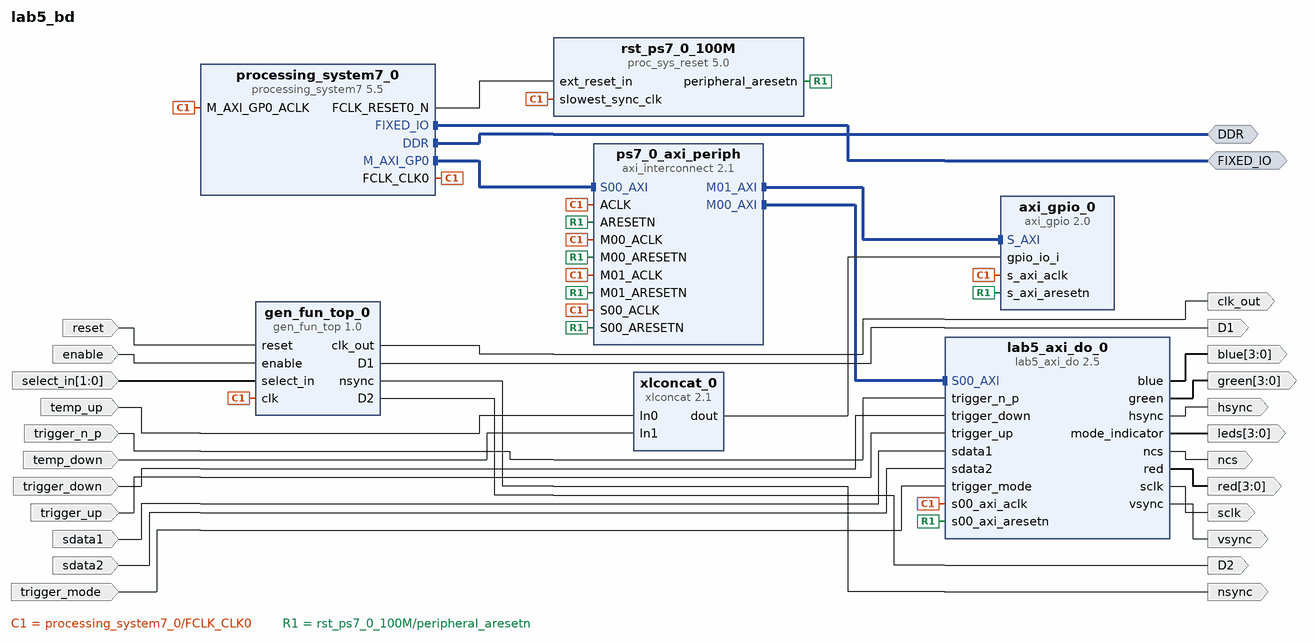
[diagram p0: block diagram of the top level]
# Vivado block design lab5_bd, xc7z020clg484-1, Vivado 2020.2
create_bd_design lab5_bd

create_bd_intf_port -mode Master -vlnv xilinx.com:interface:ddrx_rtl:1.0 DDR
create_bd_intf_port -mode Master -vlnv xilinx.com:display_processing_system7:fixedio_rtl:1.0 FIXED_IO
create_bd_port -dir O -from 3 -to 0 red
create_bd_port -dir O -from 3 -to 0 green
create_bd_port -dir O -from 3 -to 0 blue
create_bd_port -dir O hsync
create_bd_port -dir O vsync
create_bd_port -dir O ncs
create_bd_port -dir O sclk
create_bd_port -dir I sdata1
create_bd_port -dir I sdata2
create_bd_port -dir O nsync
create_bd_port -dir O D1
create_bd_port -dir O D2
create_bd_port -dir O clk_out
create_bd_port -dir I trigger_n_p
create_bd_port -dir I trigger_down
create_bd_port -dir I trigger_up
create_bd_port -dir I reset
create_bd_port -dir I enable
create_bd_port -dir I -from 1 -to 0 select_in
create_bd_port -dir I temp_up
create_bd_port -dir I temp_down
create_bd_port -dir O -from 3 -to 0 -type data leds
create_bd_port -dir I trigger_mode

create_bd_cell -type ip -vlnv xilinx.com:ip:processing_system7:5.5 processing_system7_0
set_property -dict [list \
  CONFIG.PCW_APU_PERIPHERAL_FREQMHZ 666.666667 \
  CONFIG.PCW_ENET0_ENET0_IO {MIO 16 .. 27} \
  CONFIG.PCW_ENET0_GRP_MDIO_ENABLE 1 \
  CONFIG.PCW_ENET0_GRP_MDIO_IO {MIO 52 .. 53} \
  CONFIG.PCW_ENET0_PERIPHERAL_ENABLE 1 \
  CONFIG.PCW_ENET0_RESET_ENABLE 0 \
  CONFIG.PCW_ENET_RESET_ENABLE 1 \
  CONFIG.PCW_ENET_RESET_SELECT {Share reset pin} \
  CONFIG.PCW_FPGA0_PERIPHERAL_FREQMHZ 100.000000 \
  CONFIG.PCW_FPGA1_PERIPHERAL_FREQMHZ 150.000000 \
  CONFIG.PCW_FPGA2_PERIPHERAL_FREQMHZ 50.000000 \
  CONFIG.PCW_GPIO_MIO_GPIO_ENABLE 1 \
  CONFIG.PCW_GPIO_MIO_GPIO_IO MIO \
  CONFIG.PCW_I2C_RESET_ENABLE 1 \
  CONFIG.PCW_PRESET_BANK1_VOLTAGE {LVCMOS 1.8V} \
  CONFIG.PCW_QSPI_GRP_SINGLE_SS_ENABLE 1 \
  CONFIG.PCW_QSPI_GRP_SINGLE_SS_IO {MIO 1 .. 6} \
  CONFIG.PCW_QSPI_PERIPHERAL_ENABLE 1 \
  CONFIG.PCW_QSPI_PERIPHERAL_FREQMHZ 200.000000 \
  CONFIG.PCW_QSPI_QSPI_IO {MIO 1 .. 6} \
  CONFIG.PCW_SD0_GRP_CD_ENABLE 1 \
  CONFIG.PCW_SD0_GRP_CD_IO {MIO 47} \
  CONFIG.PCW_SD0_GRP_WP_ENABLE 1 \
  CONFIG.PCW_SD0_GRP_WP_IO {MIO 46} \
  CONFIG.PCW_SD0_PERIPHERAL_ENABLE 1 \
  CONFIG.PCW_SD0_SD0_IO {MIO 40 .. 45} \
  CONFIG.PCW_SDIO_PERIPHERAL_FREQMHZ 50 \
  CONFIG.PCW_SINGLE_QSPI_DATA_MODE x4 \
  CONFIG.PCW_TTC0_PERIPHERAL_ENABLE 1 \
  CONFIG.PCW_TTC0_TTC0_IO EMIO \
  CONFIG.PCW_UART1_PERIPHERAL_ENABLE 1 \
  CONFIG.PCW_UART1_UART1_IO {MIO 48 .. 49} \
  CONFIG.PCW_UART_PERIPHERAL_FREQMHZ 50 \
  CONFIG.PCW_UIPARAM_DDR_FREQ_MHZ 533.333313 \
  CONFIG.PCW_UIPARAM_DDR_PARTNO {MT41J128M16 HA-15E} \
  CONFIG.PCW_USB0_PERIPHERAL_ENABLE 1 \
  CONFIG.PCW_USB0_RESET_ENABLE 0 \
  CONFIG.PCW_USB0_USB0_IO {MIO 28 .. 39} \
  CONFIG.PCW_USB_RESET_ENABLE 1 \
  CONFIG.PCW_USB_RESET_SELECT {Share reset pin} \
  CONFIG.preset ZedBoard \
] [get_bd_cells processing_system7_0]
# 222 more settings of processing_system7_0 are not shown: defaults, MIO pin electricals, DDR timing, and values the tool derives
create_bd_cell -type ip -vlnv xilinx.com:ip:proc_sys_reset:5.0 rst_ps7_0_100M
create_bd_cell -type ip -vlnv xilinx.com:ip:axi_interconnect:2.1 ps7_0_axi_periph
set_property -dict {CONFIG.NUM_MI 2} [get_bd_cells ps7_0_axi_periph]
create_bd_cell -type ip -vlnv xilinx.com:user:gen_fun_top:1.0 gen_fun_top_0
create_bd_cell -type ip -vlnv xilinx.com:ip:axi_gpio:2.0 axi_gpio_0
set_property -dict {CONFIG.C_GPIO_WIDTH 2 CONFIG.GPIO_BOARD_INTERFACE Custom CONFIG.USE_BOARD_FLOW true} [get_bd_cells axi_gpio_0]
create_bd_cell -type ip -vlnv xilinx.com:ip:xlconcat:2.1 xlconcat_0
create_bd_cell -type ip -vlnv UPC:user:lab5_axi_do:2.5 lab5_axi_do_0

# ---- connections ----

connect_bd_intf_net [get_bd_intf_pins processing_system7_0/M_AXI_GP0] [get_bd_intf_pins ps7_0_axi_periph/S00_AXI]
connect_bd_intf_net [get_bd_intf_pins ps7_0_axi_periph/M01_AXI] [get_bd_intf_pins axi_gpio_0/S_AXI]
connect_bd_intf_net [get_bd_intf_pins ps7_0_axi_periph/M00_AXI] [get_bd_intf_pins lab5_axi_do_0/S00_AXI]
connect_bd_intf_net [get_bd_intf_ports FIXED_IO] [get_bd_intf_pins processing_system7_0/FIXED_IO]
connect_bd_intf_net [get_bd_intf_ports DDR] [get_bd_intf_pins processing_system7_0/DDR]
connect_bd_net [get_bd_pins processing_system7_0/FCLK_CLK0] \
  [get_bd_pins rst_ps7_0_100M/slowest_sync_clk] [get_bd_pins processing_system7_0/M_AXI_GP0_ACLK] \
  [get_bd_pins ps7_0_axi_periph/S00_ACLK] [get_bd_pins ps7_0_axi_periph/M00_ACLK] [get_bd_pins ps7_0_axi_periph/ACLK] \
  [get_bd_pins gen_fun_top_0/clk] [get_bd_pins axi_gpio_0/s_axi_aclk] [get_bd_pins ps7_0_axi_periph/M01_ACLK] \
  [get_bd_pins lab5_axi_do_0/s00_axi_aclk]
connect_bd_net [get_bd_pins processing_system7_0/FCLK_RESET0_N] [get_bd_pins rst_ps7_0_100M/ext_reset_in]
connect_bd_net [get_bd_pins rst_ps7_0_100M/peripheral_aresetn] \
  [get_bd_pins ps7_0_axi_periph/S00_ARESETN] [get_bd_pins ps7_0_axi_periph/M00_ARESETN] \
  [get_bd_pins ps7_0_axi_periph/ARESETN] [get_bd_pins axi_gpio_0/s_axi_aresetn] [get_bd_pins ps7_0_axi_periph/M01_ARESETN] \
  [get_bd_pins lab5_axi_do_0/s00_axi_aresetn]
connect_bd_net [get_bd_ports reset] [get_bd_pins gen_fun_top_0/reset]
connect_bd_net [get_bd_ports enable] [get_bd_pins gen_fun_top_0/enable]
connect_bd_net [get_bd_ports select_in] [get_bd_pins gen_fun_top_0/select_in]
connect_bd_net [get_bd_pins gen_fun_top_0/clk_out] [get_bd_ports clk_out]
connect_bd_net [get_bd_pins gen_fun_top_0/nsync] [get_bd_ports nsync]
connect_bd_net [get_bd_pins gen_fun_top_0/D1] [get_bd_ports D1]
connect_bd_net [get_bd_pins gen_fun_top_0/D2] [get_bd_ports D2]
connect_bd_net [get_bd_pins xlconcat_0/dout] [get_bd_pins axi_gpio_0/gpio_io_i]
connect_bd_net [get_bd_ports trigger_n_p] [get_bd_pins lab5_axi_do_0/trigger_n_p]
connect_bd_net [get_bd_ports trigger_down] [get_bd_pins lab5_axi_do_0/trigger_down]
connect_bd_net [get_bd_ports trigger_up] [get_bd_pins lab5_axi_do_0/trigger_up]
connect_bd_net -net sdata1_1 [get_bd_ports sdata1] [get_bd_pins lab5_axi_do_0/sdata1]
connect_bd_net -net sdata2_1 [get_bd_ports sdata2] [get_bd_pins lab5_axi_do_0/sdata2]
connect_bd_net [get_bd_pins lab5_axi_do_0/red] [get_bd_ports red]
connect_bd_net [get_bd_pins lab5_axi_do_0/green] [get_bd_ports green]
connect_bd_net [get_bd_pins lab5_axi_do_0/blue] [get_bd_ports blue]
connect_bd_net [get_bd_pins lab5_axi_do_0/hsync] [get_bd_ports hsync]
connect_bd_net [get_bd_pins lab5_axi_do_0/vsync] [get_bd_ports vsync]
connect_bd_net [get_bd_pins lab5_axi_do_0/ncs] [get_bd_ports ncs]
connect_bd_net [get_bd_pins lab5_axi_do_0/sclk] [get_bd_ports sclk]
connect_bd_net [get_bd_ports temp_up] [get_bd_pins xlconcat_0/In0]
connect_bd_net [get_bd_ports temp_down] [get_bd_pins xlconcat_0/In1]
connect_bd_net [get_bd_pins lab5_axi_do_0/mode_indicator] [get_bd_ports leds]
connect_bd_net [get_bd_ports trigger_mode] [get_bd_pins lab5_axi_do_0/trigger_mode]

# ---- address map ----
assign_bd_address -offset 0x41200000 -range 64K -target_address_space [get_bd_addr_spaces processing_system7_0/Data] [get_bd_addr_segs axi_gpio_0/S_AXI/Reg]
assign_bd_address -offset 0x43C00000 -range 64K -target_address_space [get_bd_addr_spaces processing_system7_0/Data] [get_bd_addr_segs lab5_axi_do_0/S00_AXI/S00_AXI_reg]

validate_bd_design
save_bd_design
